# EAGLE schematic untitled (EAGLE 9.6.2)
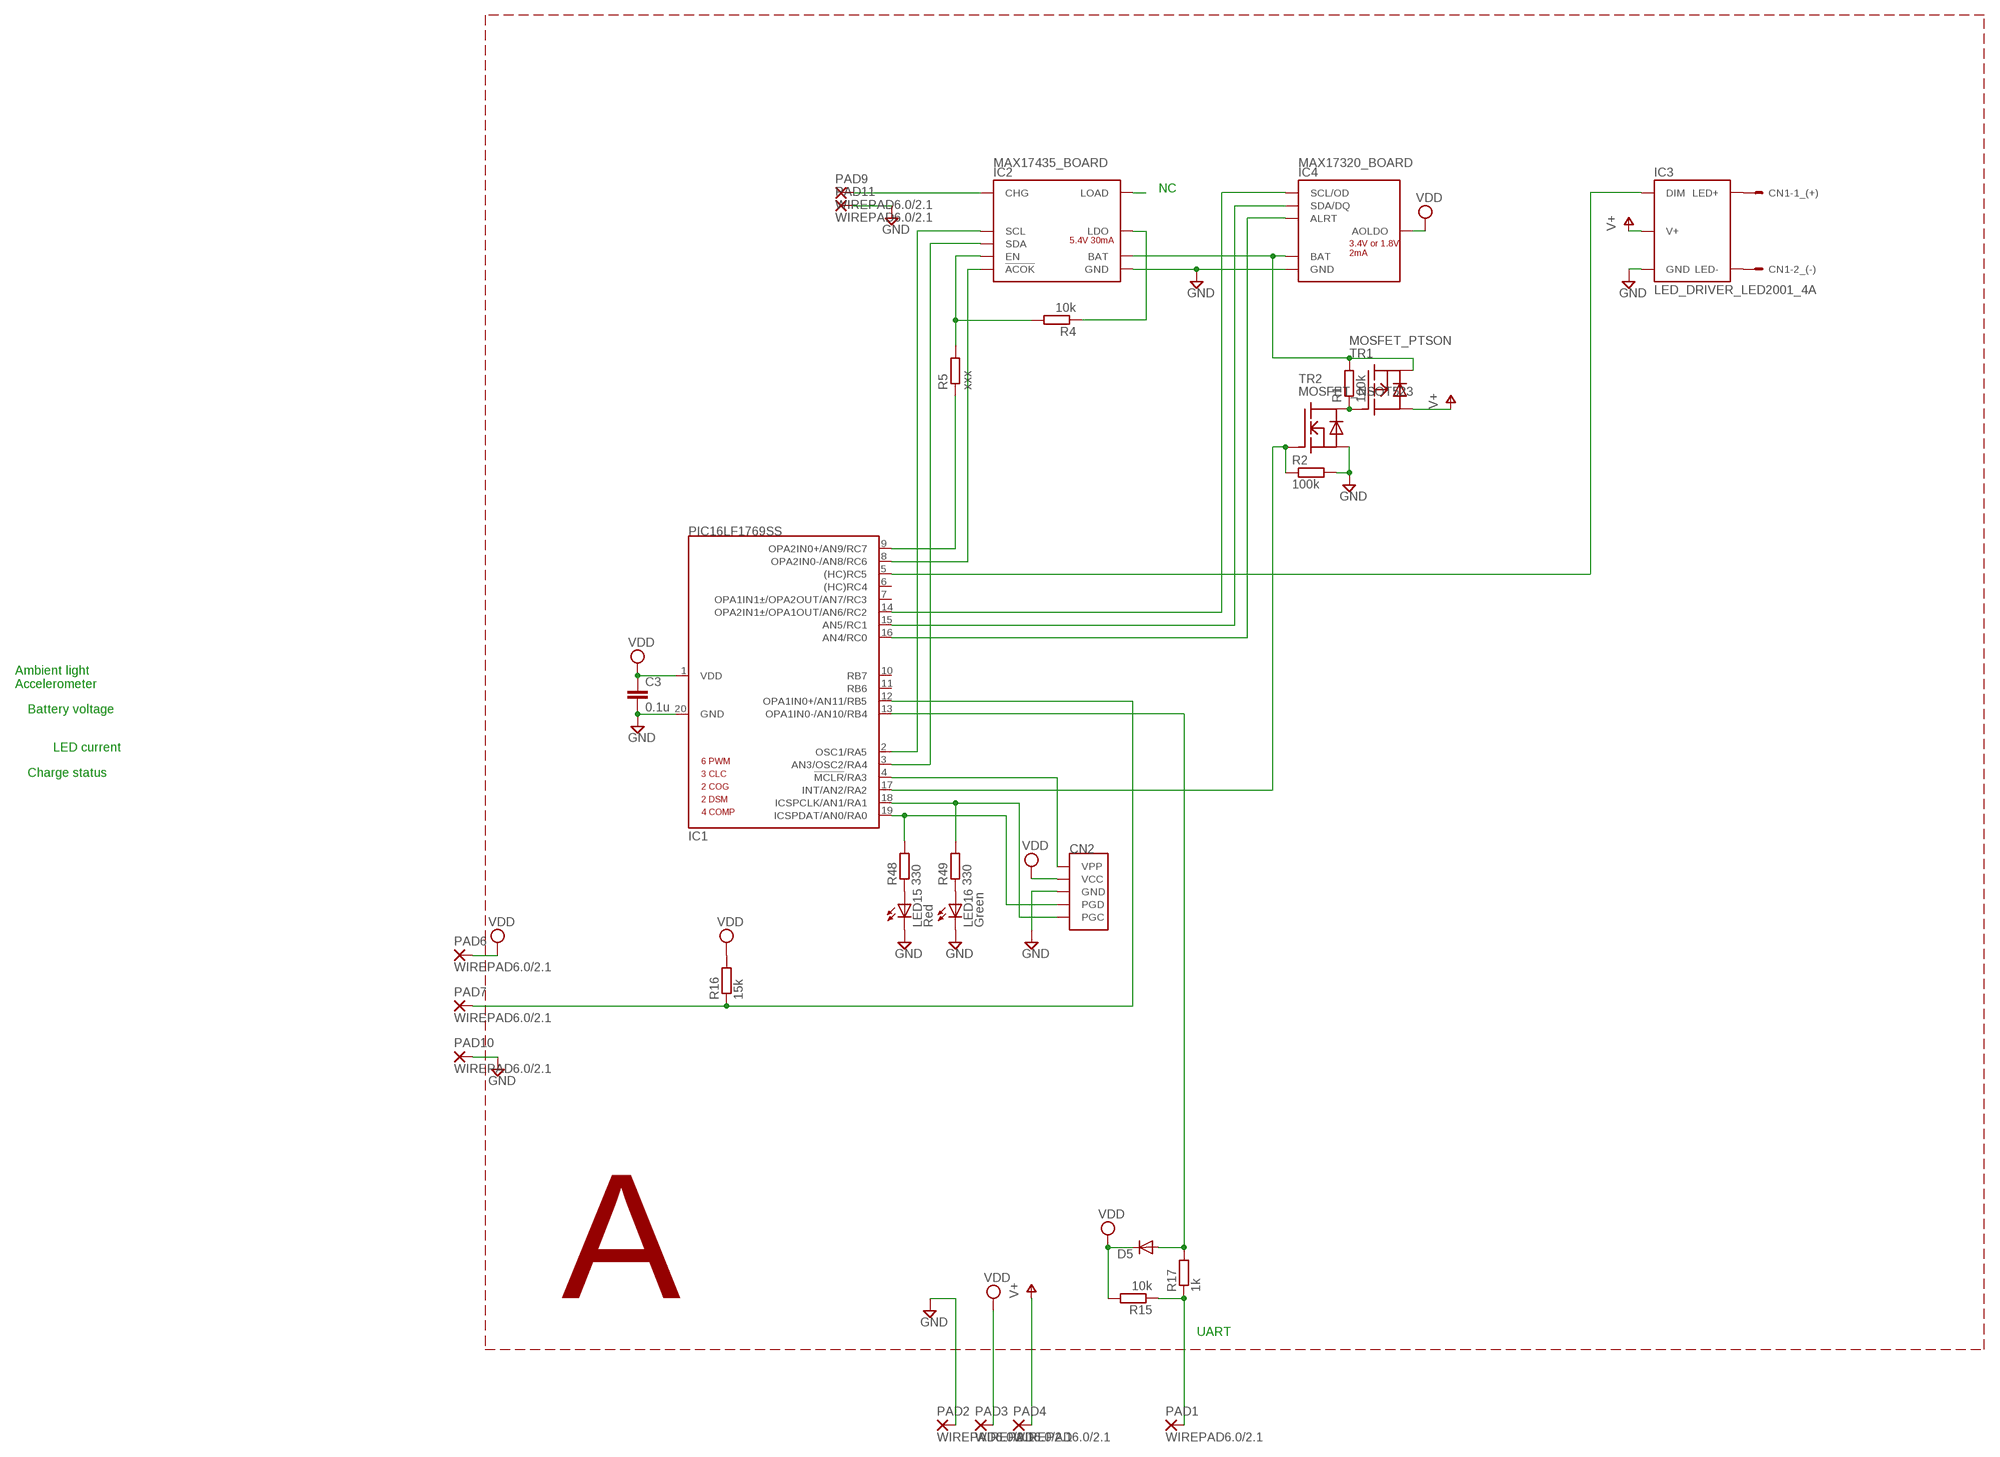
[diagram p0: schematic, sheet 1]

## Parts
C3  0.1u  C-EUC0402  [C0402]
CN1  2P_(POWER)XH_S  [XH-2_S]
CN2  ICSPEDGE  [MINI-ICSP_EDGE]
D5  DIODE-VMN2  [VMN2]
IC1  PIC16LF1769SS  PIC16F1769SS  [SSOP20]
IC2  MAX17435_BOARD  [MAX17435_BOARD]
IC3  LED_DRIVER_LED2001_4A  [LED_DRIVER_LED2001_4A]
IC4  MAX17320_BOARD  [MAX17320_BOARD]
LED15  Red  LEDCHIPLED_1606(SIDE)  [CHIP-LED1606(SIDE)]
LED16  Green  LEDCHIPLED_1606(SIDE)  [CHIP-LED1606(SIDE)]
PAD1  WIREPAD6.0/2.1  [6.0/2.1]
PAD2  WIREPAD6.0/2.1  [6.0/2.1]
PAD3  WIREPAD6.0/2.1  [6.0/2.1]
PAD4  WIREPAD6.0/2.1  [6.0/2.1]
PAD6  WIREPAD6.0/2.1  [6.0/2.1]
PAD7  WIREPAD6.0/2.1  [6.0/2.1]
PAD9  WIREPAD6.0/2.1  [6.0/2.1]
PAD10  WIREPAD6.0/2.1  [6.0/2.1]
PAD11  WIREPAD6.0/2.1  [6.0/2.1]
R1  100k  R-EU_R0402  [R0402]
R2  100k  R-EU_R0402  [R0402]
R4  10k  R-EU_R0402  [R0402]
R5  xxx  R-EU_R0402  [R0402]
R15  10k  R-EU_R0402  [R0402]
R16  15k  R-EU_R0402  [R0402]
R17  1k  R-EU_R0402  [R0402]
R48  330  R-EU_R0402  [R0402]
R49  330  R-EU_R0402  [R0402]
TR1  MOSFET_PTSON  [TSON_ADVANCE]
TR2  MOSFET_NSOT523  [SOT523]

## Nets
GND: C3.2 CN2.GND IC1.20(GND) IC2.GND IC2.GND@1(GND) IC2.GND@2(GND) IC2.GND@3(GND) IC2.GND@4(GND) IC2.GND@5(GND) IC2.GND@6(GND) IC3.GND IC3.GND@1(GND) IC3.GND@2(GND) IC4.GND IC4.GND@1(GND) IC4.GND@2(GND) IC4.GND@3(GND) IC4.GND@4(GND) IC4.GND@5(GND) IC4.GND@6(GND) LED15.C LED16.C PAD2.1(P) PAD10.1(P) PAD11.1(P) R2.2 TR2.2(S)
N$1: CN1.1 IC3.LED+
N$2: CN1.2 IC3.LED-
N$3: CN2.VPP IC1.4(!MCLR!/RA3)
N$5: IC2.CHG PAD9.1(P)
N$7: IC1.5((HC)RC5) IC3.DIM
N$8: IC2.BAT IC4.BAT IC4.BAT@1(BAT) IC4.BAT@2(BAT) R1.2 TR1.1(S) TR1.2(S) TR1.3(S)
N$9: IC1.2(OSC1/RA5) IC2.SCL
N$10: IC1.9(OPA2IN0+/AN9/RC7) R5.1
N$11: IC1.8(OPA2IN0-/AN8/RC6) IC2.!ACOK
N$12: IC1.3(AN3/OSC2/RA4) IC2.SDA
N$13: R1.1 TR1.4(G) TR2.3(D)
N$14: CN2.PGD IC1.19(ICSPDAT/AN0/RA0) R48.2
N$15: IC1.17(INT/AN2/RA2) R2.1 TR2.1(G)
N$16: CN2.PGC IC1.18(ICSPCLK/AN1/RA1) R49.2
N$17: IC2.LOAD
N$18: IC2.LDO R4.1
N$19: IC1.15(AN5/RC1) IC4.SDA/DQ
N$20: IC1.16(AN4/RC0) IC4.ALRT
N$21: IC1.14(OPA2IN1±/OPA1OUT/AN6/RC2) IC4.SCL/OD
N$22: IC2.EN R4.2 R5.2
N$23: D5.A IC1.13(OPA1IN0-/AN10/RB4) R17.2
N$31: IC1.12(OPA1IN0+/AN11/RB5) PAD7.1(P) R16.1
N$57: PAD1.1(P) R15.1 R17.1
N$103: LED15.A R48.1
N$104: LED16.A R49.1
V+: IC3.V+ PAD4.1(P) TR1.5(D) TR1.5_(D) TR1.6(D) TR1.7(D) TR1.8(D) TR1.8_(D) TR1.EP2(D) TR1.EP(D)
VDD: C3.1 CN2.VCC D5.C IC1.1(VDD) IC4.AOLDO PAD3.1(P) PAD6.1(P) R15.2 R16.2
Unconnected: IC1.6((HC)RC4) IC1.7(OPA1IN1±/OPA2OUT/AN7/RC3) IC1.10(RB7) IC1.11(RB6)

## Notes on the sheet
- NC
- Ambient light
  Accelerometer
- Battery voltage
- LED current
- Charge status
- A
- UART

## Library data of the parts
C3 = rcl:C-EU: CAPACITOR, European symbol; SPICEPREFIX: C
CN1 = 4 CONNECTOR:2P_(POWER)
CN2 = 0 my parts:ICSP
D5 = 5 D:DIODE-: DIODE
IC1 = 0 my parts:PIC16F1769
IC2 = 0 my parts:MAX17435_BOARD
IC3 = 0 my parts:LED_DRIVER_LED2001_4A
IC4 = 0 my parts:MAX17320_BOARD
LED15 LED16 = 0 my parts:LED: LED OSRAM: - CHIPLED LG R971, LG N971, LY N971, LG Q971, LY Q971, LO R971, LY R971 LH N974, LH R974 LS Q976, LO Q976, LY Q976 LO Q996 - Hyper CHIPLED LW Q18S LB Q993, LB Q99A, LB R99A - SideLED LS A670, LO A670, LY A670, LG A670, LP A670 LB A673, LV A673, LT A673, LW A673 LH A674 LY A675 LS A676, LA A676, LO A676, LY A676, LW A676 LS A679, LY A679, LG A679 - Hyper Micro SIDELED® LS Y876, LA Y876, LO Y876, LY Y876 LT Y87S - SmartLED LW L88C, LW L88S LB L89C, LB L89S, LG L890 LS L89K, LO L89K, LY L89K LS L896, LA L896, LO L896, LY L896 - TOPLED LS T670, LO T670, LY T670, LG T670, LP T670 LSG T670, LSP T670, LSY T670, LOP T670, LYG T670 LG T671, LOG T671, LSG T671 LB T673, LV T673, LT T673, LW T673 LH T674 LS T676, LA T676, LO T676, LY T676, LB T676, LH T676, LSB T676, LW T676 LB T67C, LV T67C, LT T67C, LS T67K, LO T67K, LY T67K, LW E67C LS E67B, LA E67B, LO E67B, LY E67B, LB E67C, LV E67C, LT E67C LW T67C LS T679, LY T679, LG T679 LS T770, LO T770, LY T770, LG T770, LP T770 LB T773, LV T773, LT T773, LW T773 LH T774 LS E675, LA E675, LY E675, LS T675 LS T776, LA T776, LO T776, LY T776, LB T776 LHGB T686 LT T68C, LB T68C - Hyper Mini TOPLED® LB M676 - Mini TOPLED Santana® LG M470 LS M47K, LO M47K, LY M47K Source: http://www.osram.convergy.de - LUMILED® LXK2-PW12-R00, LXK2-PW12-S00, LXK2-PW14-U00, LXK2-PW14-V00 LXK2-PM12-R00, LXK2-PM12-S00, LXK2-PM14-U00 LXK2-PE12-Q00, LXK2-PE12-R00, LXK2-PE12-S00, LXK2-PE14-T00, LXK2-PE14-U00 LXK2-PB12-K00, LXK2-PB12-L00, LXK2-PB12-M00, LXK2-PB14-N00, LXK2-PB14-P00, LXK2-PB14-Q00 LXK2-PR12-L00, LXK2-PR12-M00, LXK2-PR14-Q00, LXK2-PR14-R00 LXK2-PD12-Q00, LXK2-PD12-R00, LXK2-PD12-S00 LXK2-PH12-R00, LXK2-PH12-S00 LXK2-PL12-P00, LXK2-PL12-Q00, LXK2-PL12-R00 Source: www.luxeon.com
PAD1-PAD4 PAD6 PAD7 PAD9-PAD11 = 4 PAD:WIREPAD: Wire PAD connect wire on PCB
R1 R2 R4 R5 R15-R17 R48 R49 = rcl:R-EU_: RESISTOR, European symbol; SPICEPREFIX: R
TR1 = 0 my parts:MOSFET_P
TR2 = 0 my parts:MOSFET_N